# Altium schematic sheet Photoreciever.SchDoc
size A4
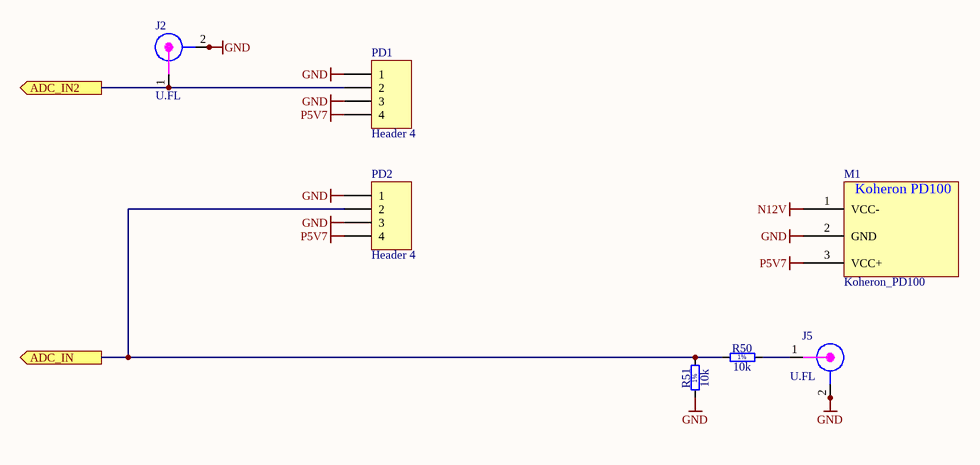
[diagram p0: Photoreciever.SchDoc]

## Parts
J2  U.FL  [CON_UFL_HIROSE_RECEPTACLE]
J5  U.FL  [CON_UFL_HIROSE_RECEPTACLE]
M1  Koheron_PD100  [Koheron_PD100]
PD1  Header 4  [HDR1X4]
PD2  Header 4  [HDR1X4]
R50  10k  [RESC1005X40N]
R51  10k  [RESC1005X40N]

## Ports
ADC_IN2 (out), ADC_IN (out)

## Nets
GND: J2.2 J2.2a(GND) J5.2 J5.2a(GND) M1.2(GND) PD1.1 PD1.3 PD2.1 PD2.3 R51.1
N12V: M1.1(VCC-)
P5V7: M1.3(VCC+) PD1.4 PD2.4
ADC_IN: PD2.2 R50.1 R51.2 ; port ADC_IN
ADC_IN2: J2.1 PD1.2 ; port ADC_IN2
NetJ5_1: J5.1 R50.2

## Notes on the sheet
- (in symbol Koheron_PD100) Koheron PD100
- (in symbol R0402_10K_1%_0.0625W_100PPM) 1%

## Library data of the parts
J2 J5 = CON_UFL_SMD: UFL; Supplier 1: Newark; Supplier Part Number 1: 50P8856
PD1 PD2 = Header 4: Header, 4-Pin; LatestRevisionDate: 17-Jul-2002; LatestRevisionNote: Re-released for DXP Platform.; Publisher: Altium Limited
R50 R51 = R0402_10K_1%_0.0625W_100PPM: Resistor - 1%; Part Description: General Purpose Thick Film Chip Resistor; Manufacturer: GENERIC; Manufacturer1 Part Number: 232270671003L; TC: ±100ppm/°C; PressFit: No; Part Number: R0402_10K_1%_0.0625W_100PPM; Component Kind: Standard; Component Type: Standard; Pin Count: 2; Value: 10k; Status: Not Recommended; Power: 0.0625W; Tolerance: ±1%; Manufacturer Part Number: R0402_10K_1%_0.0625W_100PPM; Case: 0402; Mounted: Yes; Sense: No; Socket: No; SMD: Yes; Manufacturer1 Example: YAGEO PHYCOMP; Manufacturer1 ComponentHeight: 0.4mm; HelpURL: \\cern.ch\dfs\Applications\Altium\Datasheets\R0402_Phycomp_RC0402.pdf; Author: CERN DEM JLC; CreateDate: 03.12.2007; LatestRevisionDate: 17.10.2012